# Altium schematic sheet main.SchDoc
size A4
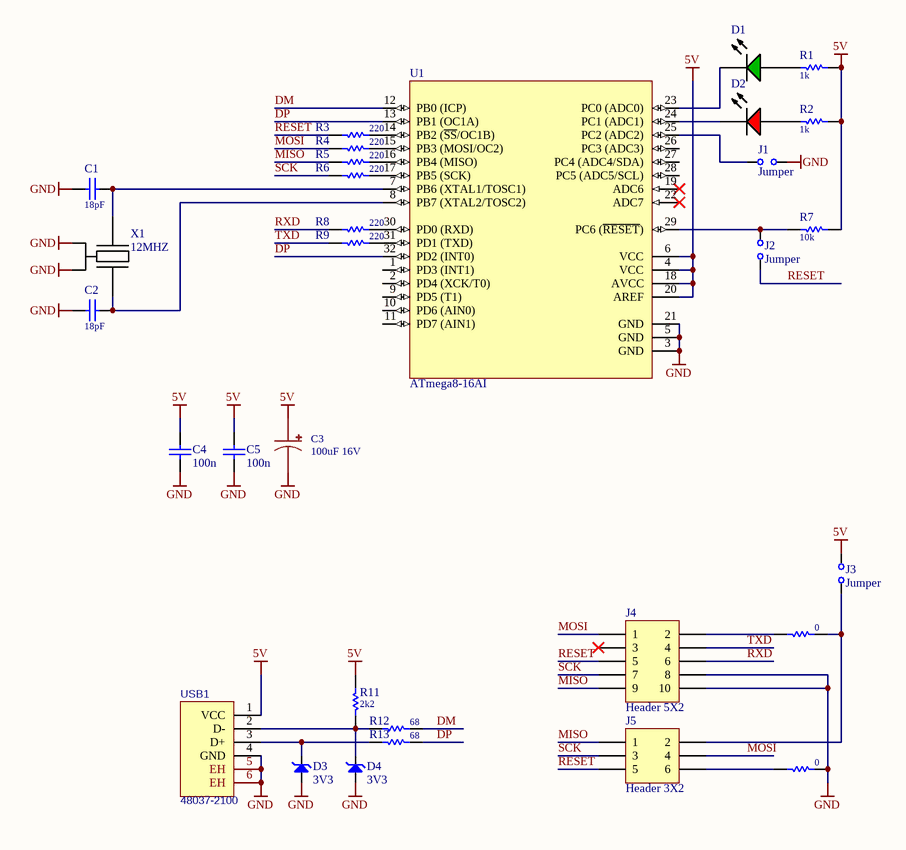
[diagram p0: main.SchDoc]

## Parts
C1  18pF  [C0402]
C2  18pF  [C0402]
C3  100uF 16V  [C3528]
C4  100n  [C0603]
C5  100n  [C0603]
D1  GRN  [LED-0603-GRN]  (value not drawn)
D2  RED  [LED-0603-GRN]  (value not drawn)
D3  3V3  [SOD-323]
D4  3V3  [SOD-323]
J1  Jumper  [JMP_0603]
J2  Jumper  [JMP_0603]
J3  Jumper  [JMP_0603]
J4  Header 5X2  [HDR_2X5]
J5  Header 3X2  [HDR_2X3]
R1  1k  [R0603]
R2  1k  [R0603]
R3  220  [R0805]
R4  220  [R0603]
R5  220  [R0603]
R6  220  [R0603]
R7  10k  [R0805]
R8  220  [R0805_]
R9  220  [R0805_]
R10  0  [R0805_]
R11  2k2  [R0603]
R12  68  [R0603]
R13  68  [R0603]
R14  0  [R0805_]
U1  ATmega8-16AI  [32A_L]
USB1  48037-2100  [USB-A-TH_480372100]
X1  12MHZ  [CRYSTAL_2.5x2.0mm]

## Nets
5V: C3.1 C4.2 C5.2 J3.1(A) R1.1 R2.1 R7.1 R11.2 U1.4(VCC) U1.6(VCC) U1.18(AVCC) U1.20(AREF) USB1.1(VCC)
GND: C1.1 C2.1 C3.2 C4.1 C5.1 D3.1(-) D4.1(-) J1.1(A) J4.8 J4.10 R14.1 U1.3(GND) U1.5(GND) U1.21(GND) USB1.4(GND) USB1.5(EH) USB1.6(EH) X1.2(GND) X1.4(GND)
DM: R12.2 U1.12(PB0_(ICP))
DP: R13.2 U1.13(PB1_(OC1A)) U1.32(PD2_(INT0))
MISO: J4.9 J5.1 R5.2
MOSI: J4.1 J5.4 R4.2
RESET: J2.2(K) J4.5 J5.5 R3.2
RXD: J4.6 R8.2
SCK: J4.7 J5.3 R6.2
TXD: J4.4 R9.2
NetC1_2: C1.2 U1.7(PB6_(XTAL1/TOSC1)) X1.3(X2)
NetC2_2: C2.2 U1.8(PB7_(XTAL2/TOSC2)) X1.1(X1)
NetD1_1: D1.1(A) R1.2
NetD1_2: D1.2(K) U1.23(PC0_(ADC0))
NetD2_1: D2.1(A) R2.2
NetD2_2: D2.2(K) U1.24(PC1_(ADC1))
NetD3_2: D3.2(+) R13.1 USB1.3(D+)
NetD4_2: D4.2(+) R11.1 R12.1 USB1.2(D-)
NetJ1_2: J1.2(K) U1.25(PC2_(ADC2))
NetJ2_1: J2.1(A) R7.2 U1.29(PC6_(~{RESET}))
NetJ3_2: J3.2(K) J5.2 R10.1
NetJ4_2: J4.2 R10.2
NetJ5_6: J5.6 R14.2
NetR3_1: R3.1 U1.14(PB2_(~{SS}/OC1B))
NetR4_1: R4.1 U1.15(PB3_(MOSI/OC2))
NetR5_1: R5.1 U1.16(PB4_(MISO))
NetR6_1: R6.1 U1.17(PB5_(SCK))
NetR8_1: R8.1 U1.30(PD0_(RXD))
NetR9_1: R9.1 U1.31(PD1_(TXD))

Not connected (* = marked no-connect by the designer): J4 3*; U1 1(PD3_(INT1)) 2(PD4_(XCK/T0)) 9(PD5_(T1)) 10(PD6_(AIN0)) 11(PD7_(AIN1)) 19(ADC6)* 22(ADC7)* 26(PC3_(ADC3)) 27(PC4_(ADC4/SDA)) 28(PC5_(ADC5/SCL))

## Library data of the parts
C1 C2 = CAP: 18pF 50V 0402
C3 = 220uF
C4 C5 = Cap
D1 = LED-0603-GREEN: LED 0603 GRN
D2 = LED-0603-RED
D3 D4 = NCP51460SN33T1G: SD03
J4 = Header 5X2: Header, 5-Pin, Dual row
J5 = Header 3X2: Header, 6-Pin, Dual row
R1-R14 = RES
U1 = ATmega8-16AI: 8-Bit AVR Microcontroller with 8K Bytes of In-System Programmable Flash Memory
X1 = CRYSTAL 12MHZ 3.20mm x 2.50mm: CRYSTAL 12MHZ 10PF SMD